# EAGLE design sdr_3157 (EAGLE 9.6.2)
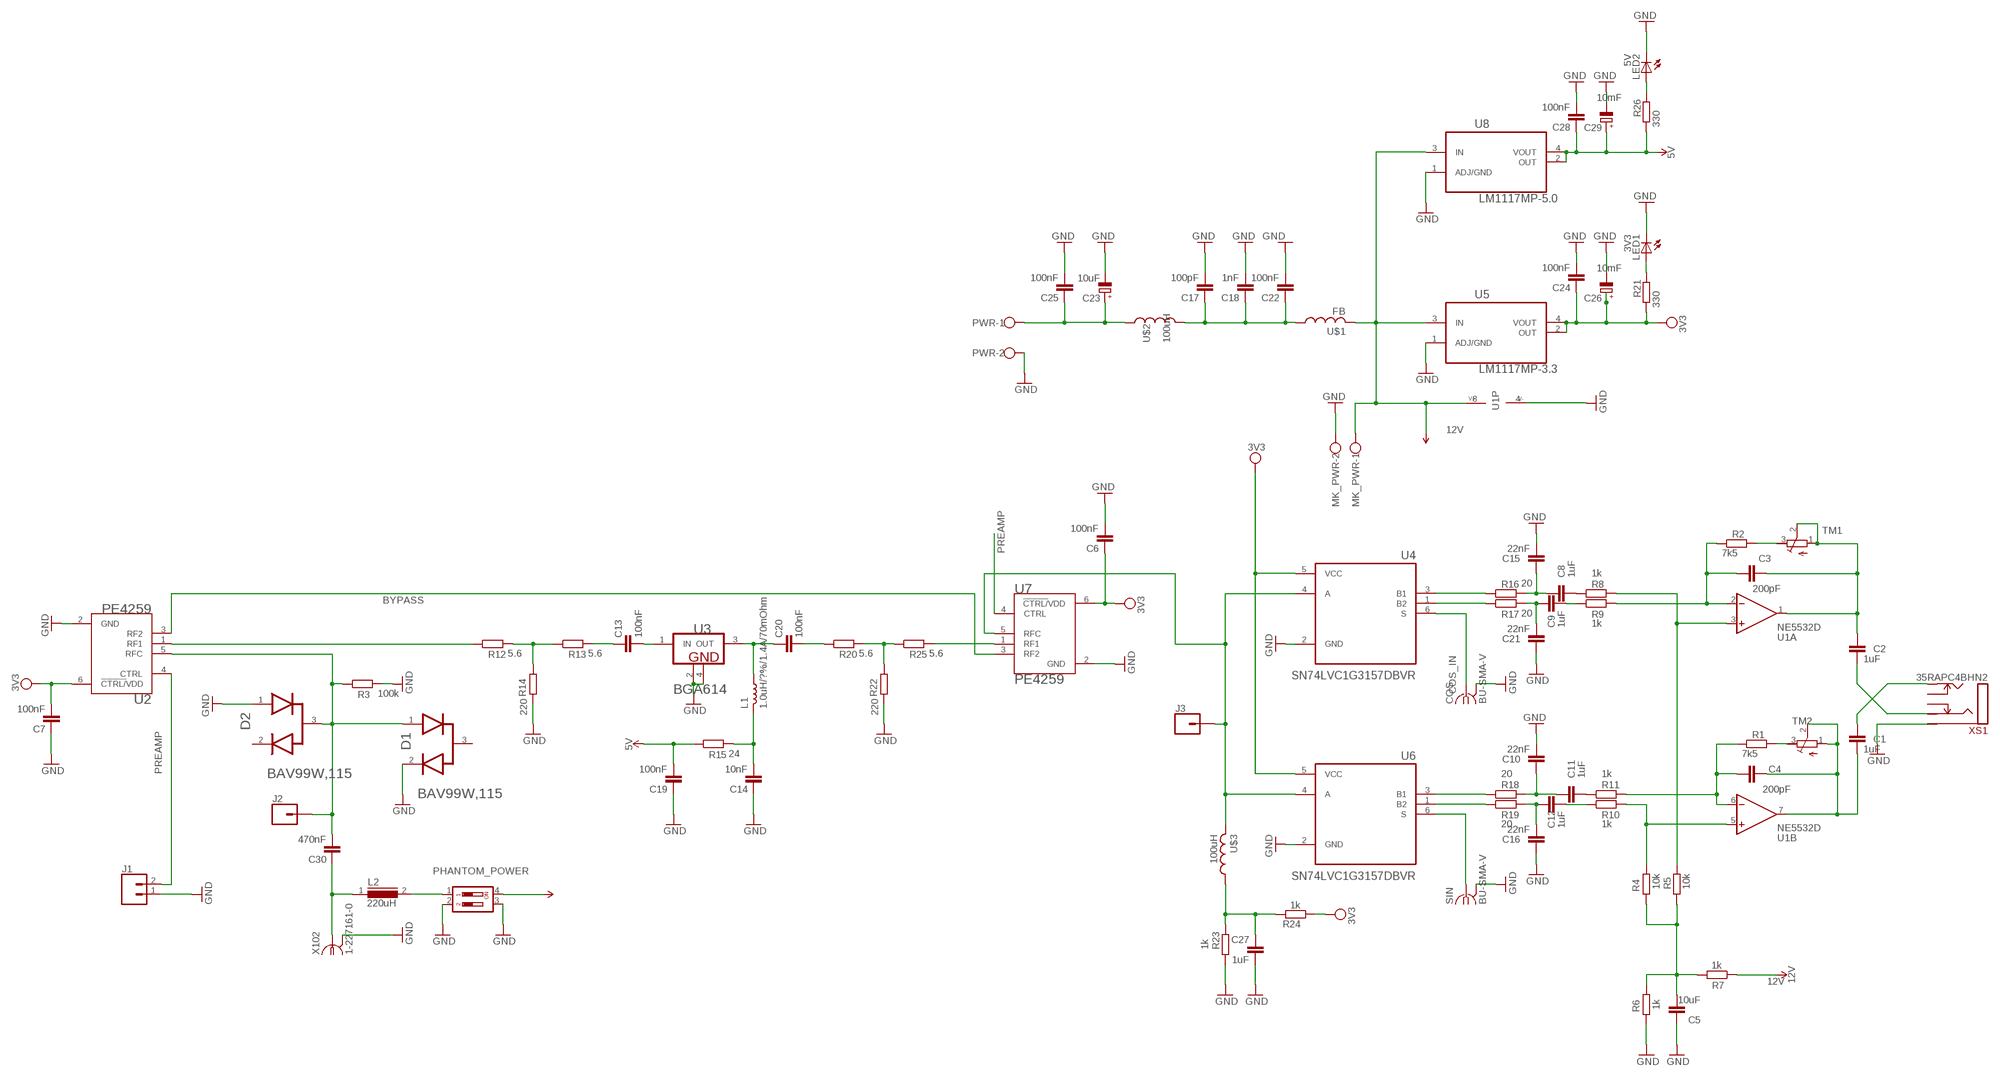
[diagram p0: schematic, sheet 1]

## Parts
C1  1uF  C-EU050-045X075  [C050-045X075]
C2  1uF  C-EU050-045X075  [C050-045X075]
C3  200pF  C-EU050-045X075  [C050-045X075]
C4  200pF  C-EU050-045X075  [C050-045X075]
C5  10uF  C-EUC0805  [C0805]
C6  100nF  C-EUC0805  [C0805]
C7  100nF  C-EUC0805  [C0805]
C8  1uF  C-EUC0805  [C0805]
C9  1uF  C-EUC0805  [C0805]
C10  22nF  C-EUC0805  [C0805]
C11  1uF  C-EUC0805  [C0805]
C12  1uF  C-EUC0805  [C0805]
C13  100nF  C-EUC0805  [C0805]
C14  10nF  C-EUC0805  [C0805]
C15  22nF  C-EUC0805  [C0805]
C16  22nF  C-EUC0805  [C0805]
C17  100pF  C-EUC0805  [C0805]
C18  1nF  C-EUC0805  [C0805]
C19  100nF  C-EUC0805  [C0805]
C20  100nF  C-EUC0805  [C0805]
C21  22nF  C-EUC0805  [C0805]
C22  100nF  C-EUC0805  [C0805]
C23  10uF  CPOL-EUSMCC  [SMC_C]
C24  100nF  C-EUC0805  [C0805]
C25  100nF  C-EUC0805  [C0805]
C26  10mF  CPOL-EUSMCC  [SMC_C]
C27  1uF  C-EUC0805  [C0805]
C28  100nF  C-EUC0805  [C0805]
C29  10mF  CPOL-EUSMCC  [SMC_C]
C30  470nF  C-EUC0805  [C0805]
COS  BU-SMA-V  [BU-SMA-V]
D1  NEXPERIA_BAV99W,115NEXPERIA_BAV99W,115_0_0  [NEXPERIA_BAV99W,115_0]
D2  NEXPERIA_BAV99W,115NEXPERIA_BAV99W,115_0_0  [NEXPERIA_BAV99W,115_0]
J1  CONN_02  [1X02]
J2  CONN_01PTH_NO_SILK_SMALL  [1X01_SMALL]
J3  CONN_01PTH_NO_SILK_SMALL  [1X01_SMALL]
L1  1.0uH/?%/1.4A/70mOhm  INDUCTOR-0805_WIDE-1.0UH  [0805-WIDE]
L2  220uH  DR73  [DR73]
LED1  3V3  LEDSMT1206  [1206]
LED2  5V  LEDSMT1206  [1206]
MK_PWR  W237-102  [W237-102]
PHANTOM_POWER  DIP02YL  [DIP02YL]
PWR  W237-102  [W237-102]
R1  7k5  R-EU_R0805  [R0805]
R2  7k5  R-EU_R0805  [R0805]
R3  100k  R-EU_R0805  [R0805]
R4  10k  R-EU_M0805  [M0805]
R5  10k  R-EU_R0805  [R0805]
R6  1k  R-EU_M0805  [M0805]
R7  1k  R-EU_M0805  [M0805]
R8  1k  R-EU_R0805  [R0805]
R9  1k  R-EU_R0805  [R0805]
R10  1k  R-EU_R0805  [R0805]
R11  1k  R-EU_M0805  [M0805]
R12  5.6  R-EU_R0805  [R0805]
R13  5.6  R-EU_R0805  [R0805]
R14  220  R-EU_R0805  [R0805]
R15  24  R-EU_R0805  [R0805]
R16  20  R-EU_R0805  [R0805]
R17  20  R-EU_R0805  [R0805]
R18  20  R-EU_R0805  [R0805]
R19  20  R-EU_R0805  [R0805]
R20  5.6  R-EU_R0805  [R0805]
R21  330  R-EU_R0805  [R0805]
R22  220  R-EU_R0805  [R0805]
R23  1k  R-EU_R0805  [R0805]
R24  1k  R-EU_R0805  [R0805]
R25  5.6  R-EU_R0805  [R0805]
R26  330  R-EU_R0805  [R0805]
SIN  BU-SMA-V  [BU-SMA-V]
TM1  5k  R-TRIMM3296W  [RTRIM3296W]
TM2  5k  R-TRIMM3296W  [RTRIM3296W]
U1  NE5532D  [SO08]
U2  PE4259  [SOT65P215X110-6N]
U3  INFINEON_BGA614INFINEON_BGA614_0_0  [INFINEON_BGA614_0]
U4  SN74LVC1G3157DBVR  [SOT95P280X145-6N]
U5  LM1117MP-3.3  [SOT230P696X180-4N]
U6  SN74LVC1G3157DBVR  [SOT95P280X145-6N]
U7  PE4259  [SOT65P215X110-6N]
U8  LM1117MP-5.0  LM1117MP-3.3  [SOT230P696X180-4N]
U$1  FB  [FB]
U$2  100uH  IHLP4040  [IHLP4040]
U$3  100uH  L-LQH55  [LQH55]
X102  1-227161-0  [AMP_227161]
XS1  35RAPC4BHN2  [35RAP]

## Nets
5V: C19.2 C28.1 C29.+ R15.1 R26.1 U8.2(OUT) U8.4(VOUT)
12V: MK_PWR.1 PHANTOM_POWER.4 R7.1 U1.8(P:V+) U5.3(IN) U8.3(IN) U$1.P$2
BYPASS: U2.3(RF2) U7.3(RF2)
COS_IN: COS.1 U4.6(S)
GND: C5.1 C6.2 C7.1 C10.2 C14.1 C15.2 C16.1 C17.2 C18.2 C19.1 C21.1 C22.2 C23.- C24.2 C25.2 C26.- C27.1 C28.2 C29.- COS.2 COS.3 COS.4 COS.5 D1.2(2_CATHODE) D2.1(1_ANODE) J1.1 LED1.C LED2.C MK_PWR.2 PHANTOM_POWER.2 PHANTOM_POWER.3 PWR.2 R3.2 R6.1 R14.2 R22.2 R23.1 SIN.2 SIN.3 SIN.4 SIN.5 U1.4(P:V-) U2.2(GND) U3.2(1_GND) U3.4(2_GND) U4.2(GND) U5.1(ADJ/GND) U6.2(GND) U7.2(GND) U8.1(ADJ/GND) X102.2 XS1.1(S)
N$1: J3.P$1 U4.4(A) U6.4(A) U7.5(RFC) U$3.2
N$2: R25.2 U7.1(RF1)
N$3: R16.1 U4.3(B1)
N$4: R17.1 U4.1(B2)
N$5: R18.1 U6.3(B1)
N$6: R12.1 U2.1(RF1)
N$7: R19.1 U6.1(B2)
N$8: C8.1 C15.1 R16.2
N$9: C9.1 C21.2 R17.2
N$10: C10.1 C11.1 R18.2
N$11: C12.1 C16.2 R19.2
N$12: C8.2 R8.1
N$13: C9.2 R9.1
N$14: C11.2 R11.1
N$15: C12.2 R10.1
N$16: R5.2 R8.2 U1.3(A:+IN)
N$17: C3.1 R2.1 R9.2 U1.2(A:-IN)
N$18: R4.2 R10.2 U1.5(B:+IN)
N$19: C4.1 R1.1 R11.2 U1.6(B:-IN)
N$20: C5.2 R4.1 R5.1 R6.2 R7.2
N$21: C2.1 C3.2 TM1.1(A) TM1.2(S) U1.1(A:OUT)
N$22: C2.2 XS1.3(R)
N$23: C1.1 XS1.2(T)
N$24: C1.2 C4.2 TM2.1(A) TM2.2(S) U1.7(B:OUT)
N$25: C27.2 R23.2 R24.2 U$3.1
N$26: LED1.A R21.2
N$27: R12.2 R13.1 R14.1
N$28: R2.2 TM1.3(E)
N$29: C13.2 U3.1(IN)
N$30: C13.1 R13.2
N$31: SIN.1 U6.6(S)
N$32: C23.+ C25.1 PWR.1 U$2.1
N$33: C17.1 C18.1 C22.1 U$1.P$1 U$2.2
N$34: C20.1 L1.1 U3.3(OUT)
N$35: C20.2 R20.1
N$36: R20.2 R22.1 R25.1
N$37: C30.1 L2.1 X102.1
N$38: C14.2 L1.2 R15.2
N$39: C30.2 D1.1(1_ANODE) D2.3(1_CATHODE/2_ANODE) J2.P$1 R3.1 U2.5(RFC)
N$40: LED2.A R26.2
N$41: R1.2 TM2.3(E)
N$42: L2.2 PHANTOM_POWER.1
PREAMP: J1.2 U2.4(CTRL) U7.4(CTRL)
VCC: C6.1 C7.2 C24.1 C26.+ R21.1 R24.1 U2.6(!CTRL/!VDD) U4.5(VCC) U5.2(OUT) U5.4(VOUT) U6.5(VCC) U7.6(!CTRL/!VDD) ; supply symbol labelled 3V3
Unconnected: D1.3(1_CATHODE/2_ANODE) D2.2(2_CATHODE) XS1.10(TN) XS1.11(RN)

## Library data of the parts
C1-C22 C24 C25 C27 C28 C30 = rcl:C-EU: CAPACITOR, European symbol; SPICEPREFIX: C
C23 C26 C29 = rcl:CPOL-EU: POLARIZED CAPACITOR, European symbol; SPICEPREFIX: C
COS SIN = con-coax:BU-SMA-V: FEMALE SMA CONNECTOR Radiall distributor RS 112-3794; OC_FARNELL: unknown; OC_NEWARK: unknown
D1 D2 = Nexperia - BAV99W,115:NEXPERIA_BAV99W,115: High-speed switching diodes; 3DS_PART_NUMBER: 412-00001; AMBIENT_TEMPERATURE_RANGE_HIGH: +150°C; AMBIENT_TEMPERATURE_RANGE_LOW: -65°C; CAPACITANCE: 1.5pF; CENTROID_NOT_SPECIFIED: No; DATASHEET: https://assets.nexperia.com/documents/data-sheet/BAV99_SER.pdf; DEVICE_CLASS_L1: Discrete Semiconductors; DEVICE_CLASS_L2: Diodes; DEVICE_CLASS_L3: Rectifier Diodes; DIGIKEY_DESCRIPTION: DIODE ARRAY GP 100V 150MA SOT323; DIGIKEY_PART_NUMBER: 1727-2915-1-ND; FOOTPRINT_PARAMETERS_0: {"fp_type":"SOT23","params":{"N":{"default":"3","long name":"Number of leads","type":"multichoice","short name":"N"},"A":{"nom":false,"long name":"Height","min":800000,"max":1100000,"short name":"A","type":"measurement"},"A1":{"nom":false,"long name":"Package clearance","min":false,"max":100000,"short name":"A1","type":"measurement"},"A2":{"nom":false,"long name":"Package height","min":false,"max":1000000,"short name":"A2","type":"measurement"},"D":{"nom":false,"long name":"Package length","min":1800000,"max":2200000,"short name":"D","type":"measurement"},"E":{"nom":false,"long name":"Width /w leads","min":2000000,"max":2200000,"short name":"E","type":"measurement"},"E1":{"nom":false,"long name":"Package width","min":1150000,"max":1350000,"short name":"E1","type":"measurement"},"B":{"nom":false,"long name":"Lead width","min":300000,"max":400000,"short name":"B","type":"measurement"},"C":{"nom":false,"long name":"Lead thickness","min":100000,"max":250000,"short name":"C","type":"measurement"},"L":{"nom":false,"long name":"Lead foot length","min":150000,"max":450000,"short name":"L","type":"measurement"},"e":{"nom":650000,"long name":"Lead pitch","min":null,"max":null,"short name":"e","type":"measurement"},"PHI":{"nom":false,"long name":"Lead angle","min":0,"max":8,"short name":"PHI","type":"measurement"},"offset x":{"nom":0,"long name":"X Center offset","min":null,"max":null,"short name":"offset x","type":"measurement"},"offset y":{"nom":0,"long name":"Y Center offset","min":null,"max":null,"short name":"offset y","type":"measurement"},"LS":{"default":"Rounded rectangle","long name":"Land shape","type":"multichoice","short name":"LS"},"LS1":{"default":"Rectangle","long name":"Land shape (Pin 1)","type":"multichoice","short name":"LS1"},"solder toe":{"nom":550000,"long name":"Solder fillet (toe)","min":null,"max":null,"short name":"solder toe","type":"fixedmeasurement"},"solder heel":{"nom":450000,"long name":"Solder fillet (heel)","min":null,"max":null,"short name":"solder heel","type":"fixedmeasurement"},"solder side":{"nom":50000,"long name":"Solder fillet (side)","min":null,"max":null,"short name":"solder side","type":"fixedmeasurement"},"courtyard":{"nom":500000,"long name":"Courtyard","min":null,"max":null,"short name":"courtyard","type":"fixedmeasurement"},"SF":{"default":"A","long name":"Packing level","type":"multichoiceparent","short name":"SF","help":"http://support.upverter.com/customer/portal/articles/978783-what-is-a-footprint-packing-level","children":["solder toe","solder heel","solder side","courtyard"]}}}; FOOTPRINT_PARAMETERS_1: {"fp_type":"SOT23","params":{"N":{"default":"3","long name":"Number of leads","type":"multichoice","short name":"N"},"A":{"nom":false,"long name":"Height","min":800000,"max":1100000,"short name":"A","type":"measurement"},"A1":{"nom":false,"long name":"Package clearance","min":false,"max":100000,"short name":"A1","type":"measurement"},"A2":{"nom":false,"long name":"Package height","min":false,"max":1000000,"short name":"A2","type":"measurement"},"D":{"nom":false,"long name":"Package length","min":1800000,"max":2200000,"short name":"D","type":"measurement"},"E":{"nom":false,"long name":"Width /w leads","min":2000000,"max":2200000,"short name":"E","type":"measurement"},"E1":{"nom":false,"long name":"Package width","min":1150000,"max":1350000,"short name":"E1","type":"measurement"},"B":{"nom":false,"long name":"Lead width","min":300000,"max":400000,"short name":"B","type":"measurement"},"C":{"nom":false,"long name":"Lead thickness","min":100000,"max":250000,"short name":"C","type":"measurement"},"L":{"nom":false,"long name":"Lead foot length","min":150000,"max":450000,"short name":"L","type":"measurement"},"e":{"nom":650000,"long name":"Lead pitch","min":null,"max":null,"short name":"e","type":"measurement"},"PHI":{"nom":false,"long name":"Lead angle","min":0,"max":8,"short name":"PHI","type":"measurement"},"offset x":{"nom":0,"long name":"X Center offset","min":null,"max":null,"short name":"offset x","type":"measurement"},"offset y":{"nom":0,"long name":"Y Center offset","min":null,"max":null,"short name":"offset y","type":"measurement"},"LS":{"default":"Rounded rectangle","long name":"Land shape","type":"multichoice","short name":"LS"},"LS1":{"default":"Rectangle","long name":"Land shape (Pin 1)","type":"multichoice","short name":"LS1"},"solder toe":{"nom":350000,"long name":"Solder fillet (toe)","min":null,"max":null,"short name":"solder toe","type":"fixedmeasurement"},"solder heel":{"nom":350000,"long name":"Solder fillet (heel)","min":null,"max":null,"short name":"solder heel","type":"fixedmeasurement"},"solder side":{"nom":30000,"long name":"Solder fillet (side)","min":null,"max":null,"short name":"solder side","type":"fixedmeasurement"},"courtyard":{"nom":250000,"long name":"Courtyard","min":null,"max":null,"short name":"courtyard","type":"fixedmeasurement"},"SF":{"default":"B","long name":"Packing level","type":"multichoiceparent","short name":"SF","help":"http://support.upverter.com/customer/portal/articles/978783-what-is-a-footprint-packing-level","children":["solder toe","solder heel","solder side","courtyard"]}}}; FOOTPRINT_PARAMETERS_2: {"fp_type":"SOT23","params":{"N":{"default":"3","long name":"Number of leads","type":"multichoice","short name":"N"},"A":{"nom":false,"long name":"Height","min":800000,"max":1100000,"short name":"A","type":"measurement"},"A1":{"nom":false,"long name":"Package clearance","min":false,"max":100000,"short name":"A1","type":"measurement"},"A2":{"nom":false,"long name":"Package height","min":false,"max":1000000,"short name":"A2","type":"measurement"},"D":{"nom":false,"long name":"Package length","min":1800000,"max":2200000,"short name":"D","type":"measurement"},"E":{"nom":false,"long name":"Width /w leads","min":2000000,"max":2200000,"short name":"E","type":"measurement"},"E1":{"nom":false,"long name":"Package width","min":1150000,"max":1350000,"short name":"E1","type":"measurement"},"B":{"nom":false,"long name":"Lead width","min":300000,"max":400000,"short name":"B","type":"measurement"},"C":{"nom":false,"long name":"Lead thickness","min":100000,"max":250000,"short name":"C","type":"measurement"},"L":{"nom":false,"long name":"Lead foot length","min":150000,"max":450000,"short name":"L","type":"measurement"},"e":{"nom":650000,"long name":"Lead pitch","min":null,"max":null,"short name":"e","type":"measurement"},"PHI":{"nom":false,"long name":"Lead angle","min":0,"max":8,"short name":"PHI","type":"measurement"},"offset x":{"nom":0,"long name":"X Center offset","min":null,"max":null,"short name":"offset x","type":"measurement"},"offset y":{"nom":0,"long name":"Y Center offset","min":null,"max":null,"short name":"offset y","type":"measurement"},"LS":{"default":"Rounded rectangle","long name":"Land shape","type":"multichoice","short name":"LS"},"LS1":{"default":"Rectangle","long name":"Land shape (Pin 1)","type":"multichoice","short name":"LS1"},"solder toe":{"nom":150000,"long name":"Solder fillet (toe)","min":null,"max":null,"short name":"solder toe","type":"fixedmeasurement"},"solder heel":{"nom":250000,"long name":"Solder fillet (heel)","min":null,"max":null,"short name":"solder heel","type":"fixedmeasurement"},"solder side":{"nom":10000,"long name":"Solder fillet (side)","min":null,"max":null,"short name":"solder side","type":"fixedmeasurement"},"courtyard":{"nom":100000,"long name":"Courtyard","min":null,"max":null,"short name":"courtyard","type":"fixedmeasurement"},"SF":{"default":"C","long name":"Packing level","type":"multichoiceparent","short name":"SF","help":"http://support.upverter.com/customer/portal/articles/978783-what-is-a-footprint-packing-level","children":["solder toe","solder heel","solder side","courtyard"]}}}; FOOTPRINT_URL: https://assets.nexperia.com/documents/outline-drawing/SOT323.pdf; FOOTPRINT_VARIANT_NAME_0: IPC_A; FOOTPRINT_VARIANT_NAME_1: IPC_B; FOOTPRINT_VARIANT_NAME_2: IPC_C; FOOTPRINT_VARIANT_NAME_3: Recommended_Land_Pattern; FORWARD_CURRENT: 130mA; HEIGHT: 1.1mm; IPC_LAND_PATTERN_NAME: SOT65P210X95-3; LEAD_FREE: yes; MAX_JUNCTION_TEMP: +150°C; MAX_REPETITIVE_REVERSE_VOLTAGE: 100V; MAX_SURGE_FORWARD_CURRENT: 4A; MF: Nexperia; MFG_PACKAGE_IDENT: SOT323; MFG_PACKAGE_IDENT_DATE: 01/2017; MFG_PACKAGE_IDENT_REV: 0; MOUSER_DESCRIPTION: Diodes - General Purpose, Power, Switching SW DBL 75V 150MA HS; MOUSER_PART_NUMBER: 771-BAV99W-T/R; MPN: BAV99W,115; PACKAGE: SOT-323; PEAK_REVERSE_CURRENT: 500mA; PREFIX: D; REVERSE_VOLTAGE: 100V; ROHS: yes; STANDOFF_HEIGHT: 0.1mm; TEMPERATURE_RANGE_HIGH: +150°C; TEMPERATURE_RANGE_LOW: -65°C; VERIFICATION_VERSION: 0.0.0.1
J1 = SparkFun-Connectors:CONN_02: Multi connection point. Often used as Generic Header-pin footprint for 0.1 inch spaced/style header connections On any of the 0.1 inch spaced packages, you can populate with these: Break Away Headers - Straight <https://www.sparkfun.com/products/116> (PRT-00116) Break Away Male Headers - Right Angle <https://www.sparkfun.com/products/553> (PRT-00553) Female Headers <https://www.sparkfun.com/products/115> (PRT-00115) Break Away Headers - Machine Pin <https://www.sparkfun.com/products/117> (PRT-00117) Break Away Female Headers - Swiss Machine Pin <https://www.sparkfun.com/products/743> (PRT-00743) For SCREWTERMINALS and SPRING TERMINALS visit here: Screw Terimnals on SparkFun.com <https://www.sparkfun.com/search/results?term=Screw+Terminals> (5mm/3.5mm/2.54mm spacing) This device is also useful as a general connection point to wire up your design to another part of your project. Our various solder wires solder well into these plated through hole pads. Hook-Up Wire - Assortment (Stranded, 22 AWG) <https://www.sparkfun.com/products/11375> (PRT-11375) Hook-Up Wire - Assortment (Solid Core, 22 AWG) <https://www.sparkfun.com/products/11367> (PRT-11367) View the entire wire category on our website here <https://www.sparkfun.com/categories/141> Special notes: Molex polarized connector foot print use with: PRT-08233 with associated crimp pins and housings. 2.54_SCREWTERM for use with PRT-10571. 3.5mm Screw Terminal footprints for PRT-08084 5mm Screw Terminal footprints for use with PRT-08432
J2 J3 = SparkFun-Connectors:CONN_01: Single connection point. Often used as Generic Header-pin footprint for 0.1 inch spaced/style header connections On any of the 0.1 inch spaced packages, you can populate with these: Break Away Headers - Straight <https://www.sparkfun.com/products/116> (PRT-00116) Break Away Male Headers - Right Angle <https://www.sparkfun.com/products/553> (PRT-00553) Female Headers <https://www.sparkfun.com/products/115> (PRT-00115) Break Away Headers - Machine Pin <https://www.sparkfun.com/products/117> (PRT-00117) Break Away Female Headers - Swiss Machine Pin <https://www.sparkfun.com/products/743> (PRT-00743) This device is also useful as a general connection point to wire up your design to another part of your project. Our various solder wires solder well into these plated through hole pads. Hook-Up Wire - Assortment (Stranded, 22 AWG) <https://www.sparkfun.com/products/11375> (PRT-11375) Hook-Up Wire - Assortment (Solid Core, 22 AWG) <https://www.sparkfun.com/products/11367> (PRT-11367) View the entire wire category on our website here <https://www.sparkfun.com/categories/141> Special notes: SMTSO-256-ET is a "flush mount" nut for a 4-40 screw. We mostly use this on specialty testbeds; it is a nice way to connect hardware to your PCB at an adjustable hieght. Also note, the SNAP packages are for using a snappable style connector. We sell a baggie of snaps and they are also used on two LilyPad designs: Snap Assortment - 30 pack (male and female) <https://www.sparkfun.com/products/11347> (DEV-11347) LilyPad Arduino SimpleSnap <https://www.sparkfun.com/products/10941> (DEV-10941) LilyPad SimpleSnap Protoboard <https://www.sparkfun.com/products/10940> (DEV-10940)
L1 = SparkFun-Coils:INDUCTOR: Inductors Resist changes in electrical current. Basically a coil of wire. SparkFun Products: SparkFun Load Cell Amplifier - HX711 <https://www.sparkfun.com/products/13879> IOIO-OTG - V2.2 <https://www.sparkfun.com/products/13613>; PROD_ID: NDUC-14237
L2 = inductors:DR73: High Power Density, High Efficiency, Shielded Inductors Source: coiltronics_dr_series.pdf; SPICEPREFIX: L
LED1 LED2 = adafruit:LED: LED OSRAM: - CHIPLED LG R971, LG N971, LY N971, LG Q971, LY Q971, LO R971, LY R971 LH N974, LH R974 LS Q976, LO Q976, LY Q976 LO Q996 - Hyper CHIPLED LW Q18S LB Q993, LB Q99A, LB R99A - SideLED LS A670, LO A670, LY A670, LG A670, LP A670 LB A673, LV A673, LT A673, LW A673 LH A674 LY A675 LS A676, LA A676, LO A676, LY A676, LW A676 LS A679, LY A679, LG A679 - Hyper Micro SIDELED® LS Y876, LA Y876, LO Y876, LY Y876 LT Y87S - SmartLED LW L88C, LW L88S LB L89C, LB L89S, LG L890 LS L89K, LO L89K, LY L89K LS L896, LA L896, LO L896, LY L896 - TOPLED LS T670, LO T670, LY T670, LG T670, LP T670 LSG T670, LSP T670, LSY T670, LOP T670, LYG T670 LG T671, LOG T671, LSG T671 LB T673, LV T673, LT T673, LW T673 LH T674 LS T676, LA T676, LO T676, LY T676, LB T676, LH T676, LSB T676, LW T676 LB T67C, LV T67C, LT T67C, LS T67K, LO T67K, LY T67K, LW E67C LS E67B, LA E67B, LO E67B, LY E67B, LB E67C, LV E67C, LT E67C LW T67C LS T679, LY T679, LG T679 LS T770, LO T770, LY T770, LG T770, LP T770 LB T773, LV T773, LT T773, LW T773 LH T774 LS E675, LA E675, LY E675, LS T675 LS T776, LA T776, LO T776, LY T776, LB T776 LHGB T686 LT T68C, LB T68C - Hyper Mini TOPLED® LB M676 - Mini TOPLED Santana® LG M470 LS M47K, LO M47K, LY M47K Source: http://www.osram.convergy.de/
MK_PWR PWR = con-wago-500:W237-102: WAGO SCREW CLAMP; MPN: 237-102; OC_FARNELL: unknown; OC_NEWARK: 70K9898
PHANTOM_POWER = switch-dil:DIP02YL: DIL/CODE SWITCH; OC_FARNELL: unknown; OC_NEWARK: unknown
R1-R26 = rcl:R-EU_: RESISTOR, European symbol; SPICEPREFIX: R
TM1 TM2 = rcl:R-TRIMM: Trimm resistor; SPICEMODEL: X; SPICEPREFIXL: POT
U1 = op-amp:NE5532: OP-AMP
U2 U7 = PE4259:PE4259: SPDT High Power UltraCMOS 10 MHz–3.0 GHz RF Switch Check prices <https://pricing.snapeda.com/parts/PE4259/pSemi/view-part?ref=eda>; AVAILABILITY: Not in stock; DESCRIPTION: RF Switch IC General Purpose SPDT 3GHz 50Ohm SC-70-6; MF: pSemi; MP: PE4259; PACKAGE: SOT-363 Peregrine Semiconductor; PRICE: None
U3 = Infineon - BGA614:INFINEON_BGA614: INF-BGA61X-4; CIIVA_IDS: 12635650; COMPONENT_LINK_1_DESCRIPTION: Manufacturer URL; COMPONENT_LINK_1_URL: http://www.infineon.com/; COMPONENT_LINK_3_DESCRIPTION: Package Specification; COMPONENT_LINK_3_URL: http://www.infineon.com/dgdl/SOT343-Package_Overview.pdf?folderId=db3a30431936bc4b0119535155343cba&fileId=db3a30431936bc4b0119535a9f393cd3; DATASHEET: http://www.infineon.com/dgdl/BGA614.pdf?folderId=db3a30431441fb5d0114b654e6581730&fileId=db3a304314dca3890115418ffd35163a&location=en.Products.RF.RF_MMIC.CATV___Broadband_Amplifier.DATASHEET.BGA614.pdf; DATASHEET_VERSION: Rev. 2.1; FOOTPRINT_VARIANT_NAME_0: Manufacturer Recommended; FREQUENCY_F: DC-6 GHz; F_TYP: 2.3 dB; GAIN_TYP: 17 dB; GREEN: yes; HALOGEN_FREE: yes; IMPORTED: yes; IMPORTED_FROM: vault; IMPORT_TS: 1521867417; I_TYP: 40 mA; MF: Infineon; MOUNTING_TECHNOLOGY: Surface Mount; MPN: BGA614; PACKAGE: SOT343; PACKAGE_DESCRIPTION: 4-Pin Small Outline Transistor Package, 1.25 x 2 mm Body; PREFIX: U; P_1DB_IN: +12; RELEASE_DATE: 1409237860; VAULT_GUID: 861FAB17-4AAE-4D86-813F-5A4E8E1EB2BD; VAULT_REVISION: 3B698CA1-9EFF-4F94-8622-FCA14140CF6A
U4 U6 = SN74LVC1G3157DBVR:SN74LVC1G3157DBVR: Check prices <https://pricing.snapeda.com/parts/SN74LVC1G3157DBVR/Texas%20Instruments/view-part?ref=eda>; AVAILABILITY: In Stock; DESCRIPTION: 5-V, 2:1 (SPDT), 1-channel general-purpose analog switch 6-SOT-23 -40 to 125; MF: Texas Instruments; MP: SN74LVC1G3157DBVR; PACKAGE: SOT-23-6 Texas Instruments; PRICE: None; PURCHASE-URL: https://pricing.snapeda.com/search/part/SN74LVC1G3157DBVR/?ref=eda
U5 U8 = LM1117MP-3.3:LM1117MP-3.3: Linear regulators Check prices <https://pricing.snapeda.com/parts/LM1117MP-3.3/Texas%20Instruments/view-part?ref=eda>; AVAILABILITY: In Stock; DESCRIPTION: Linear Voltage Regulator IC Positive Fixed 1 Output 800mA SOT-223; MF: Texas Instruments; MP: LM1117MP-3.3; PACKAGE: SOT-223-3 Texas Instruments; PRICE: None; PURCHASE-URL: https://pricing.snapeda.com/search/part/LM1117MP-3.3/?ref=eda
U$1 = adafruit:FB: Ferrite bead Digikey #P9821BK-ND
U$2 = smd-inductors:IHLP4040
U$3 = adafruit:L
X102 = !con-coax:?227161*: JACK, RIGHT ANGLE, 50 OHM, PCB, BNC Source: amp_227161.pdf; MF: TYCO ELECTRONICS; MPN: 1-227161; OC_FARNELL: unknown; OC_NEWARK: 33B3200
XS1 = connectors:35RAPC4BHN2; MOUSER: 502-35RAPC4BHN2

## Board
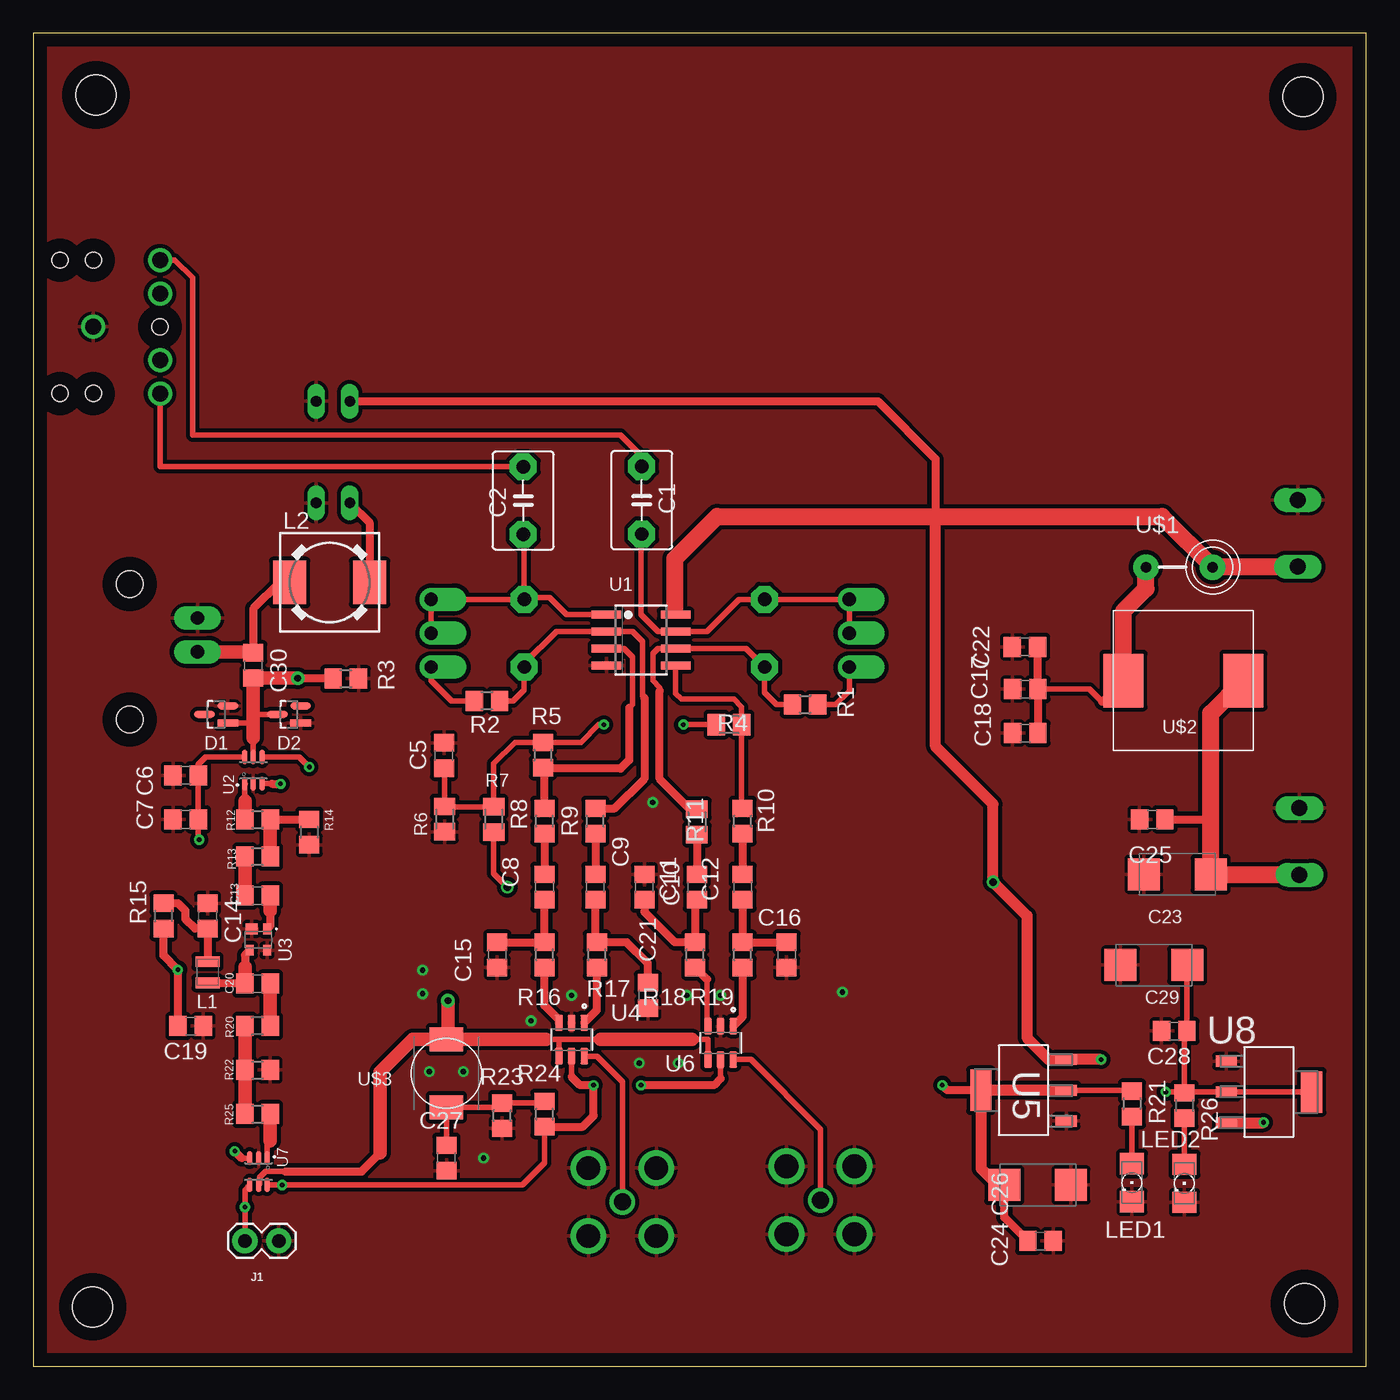
[diagram p1: board, top side]
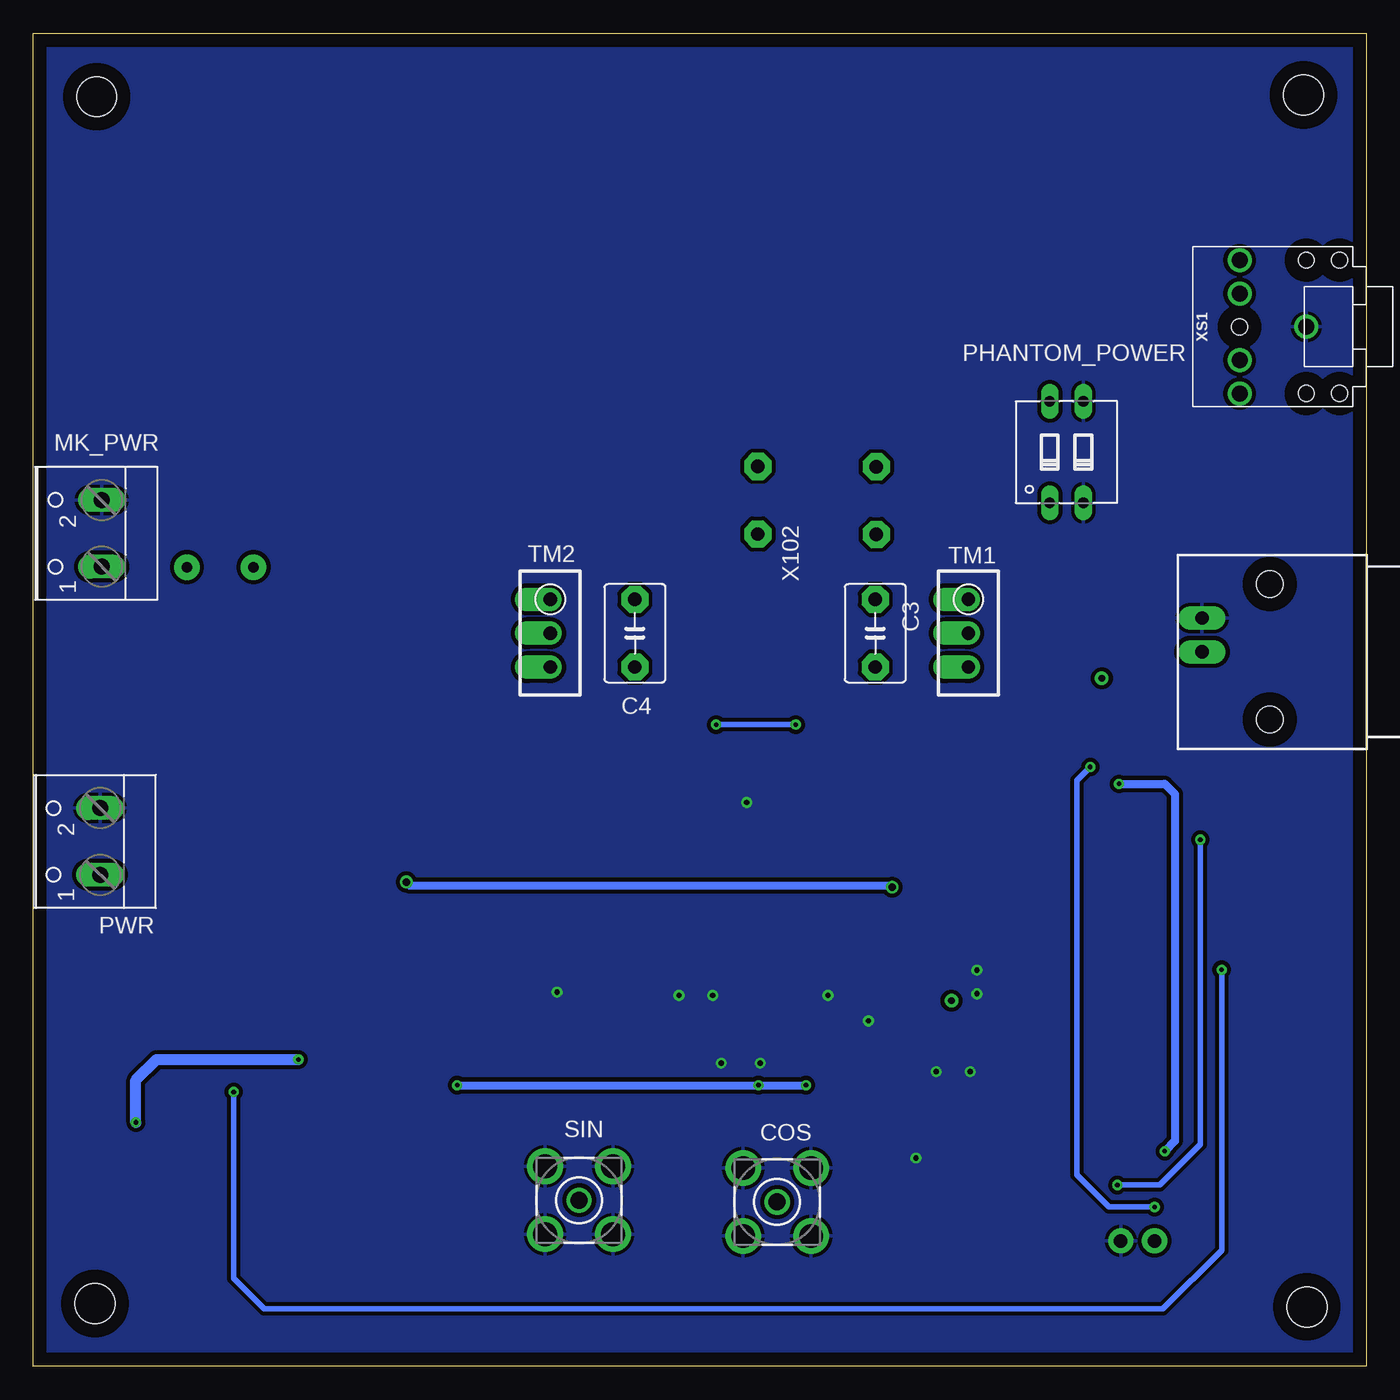
[diagram p2: board, bottom side, seen from below]

Size 100 x 100 mm. Coordinates in mm from the lower left corner, seen from the top.
Outline: 0,0 100,0 100,100 0,100 0,0
Copper layers (1*16): Top 0.035mm / dielectric 1.5mm / Bottom 0.035mm
Design rules "default": minimum track width 6mil, minimum drill 0.35mm, track to track 6mil, track to pad 6mil, pad to pad 6mil, via to via 6mil, smd to smd 6mil, copper to edge 40mil, drill to drill 6mil, minimum pad ring 10mil, minimum via ring 8mil, stop-mask expansion 4mil, vias tented up to drill 0mil, thermal gap 10mil
Holes 3 mm at 4.45,4.45 4.7,95.38 95.25,95.25 95.38,4.7

### Footprints (pad centres in the part's own frame; a part is rotated, then mirrored left to right if it is on the bottom)
C050-045X075 = drill 1 pad 2.032 octagon: 1 -2.54,0; 2 2.54,0
C0805 = smd 1.3 x 1.5: 1 -0.95,0; 2 0.95,0
SMC_C = smd 2.4 x 2.4: + -2.5,0; - 2.5,0
BU-SMA-V = drill 1.27: 1 0,0 | drill 1.778: 2 -2.55,2.55; 3 2.55,2.55; 4 2.55,-2.55; 5 -2.55,-2.55
NEXPERIA_BAV99W,115_0 = smd 1.559 x 0.522: 1 -0.877,0.65; 2 -0.877,-0.65; 3 0.877,0
1X02 = drill 1.016 pad 1.88: 1 0,0; 2 2.54,0
1X01_SMALL = drill 0.508: P$1 0,0
0805-WIDE = smd 0.8 x 1.8: 1 -0.8,0; 2 0.8,0
DR73 = smd 2.5 x 3.25: 1 -3,0; 2 3,0
1206 = smd 1.6 x 1.803: A -1.422,0; C 1.422,0
W237-102 = drill 1.194 long: 1 -2.5,-1.27; 2 2.5,-1.27
DIP02YL = drill 0.813 long: 1 -1.27,-3.81; 2 1.27,-3.81; 3 1.27,3.81; 4 -1.27,3.81
R0805 = smd 1.3 x 1.5: 1 -0.95,0; 2 0.95,0
M0805 = smd 1.3 x 1.6: 1 -0.95,0; 2 0.95,0
RTRIM3296W = drill 1 pad 1.778 offset: 1 0,-2.54; 2 0,0; 3 0,2.54
SO08 = smd 0.6 x 2.2: 1 -1.905,-2.6; 2 -0.635,-2.6; 3 0.635,-2.6; 4 1.905,-2.6; 5 1.905,2.6; 6 0.635,2.6; 7 -0.635,2.6; 8 -1.905,2.6
SOT65P215X110-6N = smd 1.05 x 0.4: 1 -1,0.65; 2 -1,0; 3 -1,-0.65; 4 1,-0.65; 5 1,0; 6 1,0.65
INFINEON_BGA614_0 = smd 0.8 x 0.6: 1 -0.8,0.65; 3 0.8,-0.65; 4 0.8,0.65 | smd 0.8 x 0.9: 2 -0.8,-0.5
SOT95P280X145-6N = smd 1.21 x 0.58: 1 -1.255,0.95; 2 -1.255,0; 3 -1.255,-0.95; 4 1.255,-0.95; 5 1.255,0; 6 1.255,0.95
SOT230P696X180-4N = smd 1.6 x 0.838: 1 -3.2,2.311; 2 -3.2,0; 3 -3.2,-2.311 | smd 1.6 x 3.099: 4 3.2,0
FB = drill 0.8 pad 1.93: P$1 -2.5,0; P$2 2.5,0
IHLP4040 = smd 3 x 4: 1 -4.5,0; 2 4.5,0
LQH55 = smd 1.8 x 2.5: 1 -2.55,0; 2 2.55,0
AMP_227161 = drill 1 pad 1.778 long: 1 0,-5.08; 2 -2.54,-5.08 | hole 2: -5.08,0; 5.08,0
35RAP = drill 1.2: 1 4.5,0; 2 9.5,-5; 3 9.5,5; 10 9.5,-2.5; 11 9.5,2.5 | hole 1.2: 2,5; 2,-5; 4.5,5; 4.5,-5; 9.5,0

### Placement (x,y rotation side)
C1  45.64,64.97 270 top
C2  36.75,64.95 90 top
C3  36.83,54.99 90 bottom
C4  54.86,54.99 90 bottom
C5  30.81,45.82 270 top
C6  11.43,44.32 180 top
C7  11.43,41.02 0 top
C8  38.35,35.94 90 top
C9  42.16,35.94 90 top
C10  45.85,35.94 90 top
C11  49.78,35.94 90 top
C12  53.21,35.94 90 top
C13  16.83,35.31 0 top
C14  13.08,33.78 270 top
C15  34.8,30.86 270 top
C16  56.52,30.86 90 top
C17  74.42,50.8 180 top
C18  74.42,47.5 180 top
C19  11.81,25.53 180 top
C20  16.83,28.7 0 top
C21  46.1,27.81 90 top
C22  74.4,53.98 180 top
C23  85.83,36.91 180 top
C24  75.56,9.4 0 top
C25  83.95,41.02 180 top
C26  75.35,13.59 0 top
C27  30.99,15.62 90 top
C28  85.6,25.15 180 top
C29  84.07,30.1 180 top
C30  16.51,52.58 270 top
COS  44.2,12.32 0 bottom
D1  13.72,48.9 180 top
D2  19.18,48.9 180 top
J1  18.41,9.4 180 top
J2  19.84,51.61 0 top
J3  31.11,27.43 0 top
L1  13.08,29.55 90 top
L2  22.23,58.8 0 top
LED1  82.42,13.77 270 top
LED2  86.36,13.72 270 top
MK_PWR  96.14,62.48 90 bottom
PHANTOM_POWER  22.48,68.58 0 bottom
PWR  96.27,39.37 90 bottom
R1  57.91,49.66 0 top
R2  34.04,49.91 180 top
R3  23.44,51.59 0 top
R4  52.2,48.13 0 top
R5  38.23,45.85 270 top
R6  30.86,41.05 90 top
R7  34.54,41.02 90 top
R8  38.35,40.89 90 top
R9  42.16,40.89 90 top
R10  53.21,40.89 90 top
R11  49.78,40.83 90 top
R12  16.83,41.02 0 top
R13  16.82,38.23 180 top
R14  20.7,40.07 270 top
R15  9.78,33.78 90 top
R16  38.35,30.86 90 top
R17  42.29,30.86 90 top
R18  49.66,30.86 90 top
R19  53.21,30.86 90 top
R20  16.82,25.53 180 top
R21  82.42,19.68 270 top
R22  16.83,22.23 0 top
R23  35.18,18.8 90 top
R24  38.35,18.92 90 top
R25  16.83,18.92 0 top
R26  86.36,19.56 270 top
SIN  59.05,12.45 0 bottom
TM1  29.84,54.99 180 bottom
TM2  61.21,54.99 180 bottom
U1  45.59,54.48 270 top
U2  16.51,44.7 90 top
U3  16.89,32 270 top
U4  40.39,24.51 270 top
U5  74.3,20.7 180 top
U6  51.56,24.26 270 top
U7  16.89,14.61 270 top
U8  92.71,20.57 0 top
U$1  85.98,59.94 0 top
U$2  86.29,51.44 180 top
U$3  30.99,21.97 90 top
X102  7.24,53.59 270 bottom
XS1  0,77.98 180 bottom

### Tracks (layer width: path | path; a pad name or v marks a point on that pad's centre or on a via)
5V  (via drill 0.35)
  Top 0.406: 86.43,20.57 R26.1 86.36,24.96 C28.1 86.55,30.07 C29.+ | 86.43,20.57 U8.2 U8.4 | v84.96,20.57 86.43,20.57
  Top 0.61: C19.2 10.86,29.73 v10.85,29.74 9.78,30.81 R15.1
  Bottom 0.406: v84.96,20.57 84.96,6.6 82.68,4.32 15.24,4.32 10.85,8.71 v10.85,29.74
12V  (via drill 0.35, 0.55)
  Top 0.406: R7.1 34.54,36.96 v35.56,35.94
  Top 0.61: 48.13,56.9 48.13,56.45 U1.8 | PHANTOM_POWER.4 63.37,72.39 67.69,68.07 67.69,63.75
  Top 0.813: U8.3 92.28,18.26 v92.3,18.29 | v80.11,23.01 U5.3 76.17,23.01 74.55,24.64 74.55,33.78 v72.01,36.32 72.01,42.16 67.69,46.48 67.69,63.75
  Top 1.27: MK_PWR.1 94.83,59.94 U$1.P$2 84.67,63.75 67.69,63.75 51.31,63.75 48.13,60.58 48.13,56.9
  Bottom 0.61: v72.01,36.32 71.75,36.07 35.69,36.07 v35.56,35.94
  Bottom 0.813: v92.3,18.29 92.3,21.46 90.75,23.01 v80.11,23.01
BYPASS  (via drill 0.35)
  Top 0.406: 18.53,43.7 v18.54,43.69 | 15.64,15.61 U7.3 | U2.3 17.89,43.7 17.91,43.69
  Top 0.61: v15.11,16.13 15.64,15.61 | 17.91,43.69 18.51,43.69 18.53,43.7
  Bottom 0.61: v18.54,43.69 15.11,43.69 14.35,42.93 14.35,16.89 v15.11,16.13
COS_IN
  Top 0.406: COS.1 44.2,21.34 42.28,23.26 U4.6
GND  (via drill 0.4)
  other vias: 60.71,28.07 40.39,27.81 49.02,27.81 46.48,42.29 51.56,27.81 37.34,25.91 33.78,15.62 29.72,22.1 29.21,27.94 29.21,29.72 32.26,22.1 45.47,22.73 48.39,22.73
  pour Top (isolate 0.305): 103.76,-3.81 -1.91,-3.81 -1.91,102.49 103.76,102.49
  pour Bottom (isolate 0.305): -1.78,102.11 -1.78,-3.05 103.38,-3.05 103.38,102.11
N$1
  Top 0.406: U6.4 50.61,24.51 49.4,24.51 | U4.4 39.44,24.51 | U7.5 16.98,13.7 16.98,14.16 17.43,14.61 18.92,14.61 | 39.44,24.51 38.48,24.51 | 39.44,24.51 42.55,24.51
  Top 0.61: 18.92,14.61 24.64,14.61 26.04,16
  Top 1.016: 38.48,24.51 U$3.2 | U$3.2 | 42.55,24.51 49.4,24.51 | 26.04,16 26.04,22.1 28.45,24.51 U$3.2 | J3.P$1 31.11,24.63 U$3.2
N$2
  Top 0.406: U7.1 17.54,16.65 17.78,16.89
  Top 1.016: 17.78,16.89 R25.2
N$3
  Top 0.61: U4.3 39.44,25.97 38.35,27.05 R16.1
N$4
  Top 0.61: U4.1 42.29,26.72 R17.1
N$5
  Top 0.406: U6.3 50.55,25.58 50.55,29.02
  Top 0.61: R18.1 50.55,29.02
N$6
  Top 0.406: 15.88,43.68 U2.1 15.86,42.43 15.88,42.42
  Top 1.016: 15.88,42.42 15.88,42.41 R12.1
N$7
  Top 0.61: R19.1 53.21,26.21 U6.1
N$8
  Top 0.61: C15.1 R16.2 C8.1
N$9
  Top 0.61: C21.2 46.1,30.23 44.52,31.81 R17.2 42.16,31.94 C9.1
N$10
  Top 0.61: C11.1 49.66,34.86 R18.2 48.13,31.81 45.85,34.1 C10.1
N$11
  Top 0.61: C12.1 R19.2 C16.2
N$12
  Top 0.61: R8.1 C8.2
N$13
  Top 0.61: R9.1 C9.2
N$14
  Top 0.61: R11.1 C11.2
N$15
  Top 0.61: R10.1 C12.2
N$16
  Top 0.406: 44.7,49.4 44.96,49.66 44.96,53.21 44.32,53.85 U1.3
  Top 0.61: R8.2 38.35,44.83 | R5.2 38.23,44.83 38.35,44.83 | 44.7,49.4 44.7,45.47 44.07,44.83 38.35,44.83
N$17
  Top 0.406: 45.85,50.16 45.72,50.29 45.72,54.36 44.96,55.12 U1.2 39.24,55.12 36.83,52.7 C3.1 36.83,50.74 36,49.91 R2.1
  Top 0.61: R2.1 34.99,50.27 | 45.85,50.16 45.85,44.07 43.62,41.84 R9.2
N$18
  Top 0.406: R10.2 53.15,41.91 R4.2 53.15,49.47 52.58,50.04 48.64,50.04 48.19,50.49 U1.5
N$19
  Top 0.406: 46.99,50.67 46.99,50.93 46.48,51.44 46.48,53.47 46.86,53.85 U1.6 53.47,53.85 C4.1 54.86,50.55 55.75,49.66 R1.1
  Top 0.61: R11.2 49.28,41.78 46.99,44.07 46.99,50.67
N$20  (via drill 0.35)
  Top 0.406: C5.2 30.86,44.82 R6.2 30.89,41.97 R7.2 34.54,45.21 36.13,46.8 R5.1 41.08,46.8 42.42,48.13 v42.8,48.13 | R4.1 v48.77,48.13
  Top 0.61: 38.29,46.8 R5.1 38.17,46.74 | R7.2 34.38,42.12
  Bottom 0.406: v48.77,48.13 v42.8,48.13
N$21
  Top 0.406: U1.1 40.01,56.39 38.73,57.66 36.83,57.66 36.7,57.53 | TM1.2 TM1.1 36.7,57.53 | 36.7,57.53 C3.2 36.83,62.33 C2.1
N$22
  Top 0.406: C2.2 9.5,67.49 XS1.3
N$23
  Top 0.406: C1.1 45.64,68.28 44.07,69.85 11.94,69.85 11.94,81.66 10.62,82.98 XS1.2
N$24
  Top 0.406: TM2.2 TM2.1 C4.2 52.96,57.53 50.55,55.12 U1.7 46.86,55.12 45.59,56.39 45.59,62.38 C1.2
N$25
  Top 0.406: C27.2 U$3.1 34.85,19.42 R23.2 38.23,19.75 R24.2
N$26
  Top 0.406: R21.2 LED1.A
N$27
  Top 0.61: R12.2 R14.1
  Top 1.016: R12.2 R13.1
N$28
  Top 0.406: R2.2 31.37,49.91 29.84,51.44 TM1.3
N$29
  Top 0.61: 17.78,34.16 17.78,33.04 U3.1
  Top 1.016: C13.2 17.78,34.16
N$30
  Top 1.016: R13.2 C13.1
N$31
  Top 0.406: SIN.1 59.05,17.78 53.83,23 U6.6
N$32
  Top 0.61: C23.+ | C25.1 88.33,41.02
  Top 1.27: U$2.1 88.33,48.97 88.33,41.02 C23.+ 88.36,36.87 PWR.1
N$33
  Top 0.406: C17.1 79.24,50.8 80.2,49.84
  Top 0.61: 80.2,49.84 U$2.2 | C22.1 75.35,50.83 C17.1 C18.1
  Top 1.27: U$2.2 81.79,56.64 83.48,58.33 U$1.P$1
N$34
  Top 0.61: U3.3 15.88,30.84 15.88,29.97 | C20.1 13.13,28.7 L1.1
  Top 1.016: 15.88,29.97 C20.1
N$35
  Top 1.016: C20.2 R20.1
N$36
  Top 1.016: R20.2 R22.1 R25.1
N$37
  Top 0.406: 18.59,59.44 L2.1
  Top 0.61: L2.1 18.48,58.8 16.51,56.83 C30.1
  Top 1.016: X102.1 16.44,53.59 C30.1
N$38
  Top 0.61: R15.2 10.86,34.73 11.43,34.16 11.43,33.53 12.13,32.83 C14.2 L1.2
N$39
  Top 0.406: 16.51,47.12 U2.5 | D2.3 16.51,48.9 | D1.1 16.4,48.24 16.51,48.13
  Top 0.61: J2.P$1 22.47,51.61 R3.1
  Top 1.016: 16.51,47.12 16.51,48.13 16.51,48.9 C30.2 16.52,51.61 J2.P$1
N$40
  Top 0.406: LED2.A R26.2
N$41
  Top 0.406: R1.2 60.2,49.66 61.21,50.67 TM2.3
N$42
  Top 0.61: PHANTOM_POWER.1 25.23,63.29 L2.2
PREAMP  (via drill 0.35)
  Top 0.406: U2.4 19.95,45.7 v20.7,44.96 | U7.4 15.88,13.24 v15.88,11.94 J1.2
  Bottom 0.406: v15.88,11.94 19.3,11.94 21.72,14.35 21.72,43.94 v20.7,44.96
VCC  (via drill 0.35)
  Top 0.406: U7.6 18.65,13.61 v18.67,13.59 36.7,13.59 38.35,15.24 R24.1 | v12.45,39.5 12.38,39.56 C7.2 C6.1 12.38,45.15 12.94,45.7 U2.6 | U5.2 82.36,20.7 R21.1 | U6.5 51.56,21.59 | 40.39,21.72 U4.5
  Top 0.61: C24.1 72.85,11.16 C26.+ | 51.56,21.59 51.05,21.08 v45.59,21.08 | 40.39,21.72 41.02,21.08 v42.04,21.08 42.04,18.8 41.21,17.97 R24.1 | U5.4 68.58,20.7 v68.2,21.08
  Top 0.813: U5.2 U5.4 71.09,14.84 72.34,13.59 C26.+
  Bottom 0.406: v18.67,13.59 15.49,13.59 12.45,16.64 v12.45,39.5
  Bottom 0.61: v42.04,21.08 v45.59,21.08 v68.2,21.08